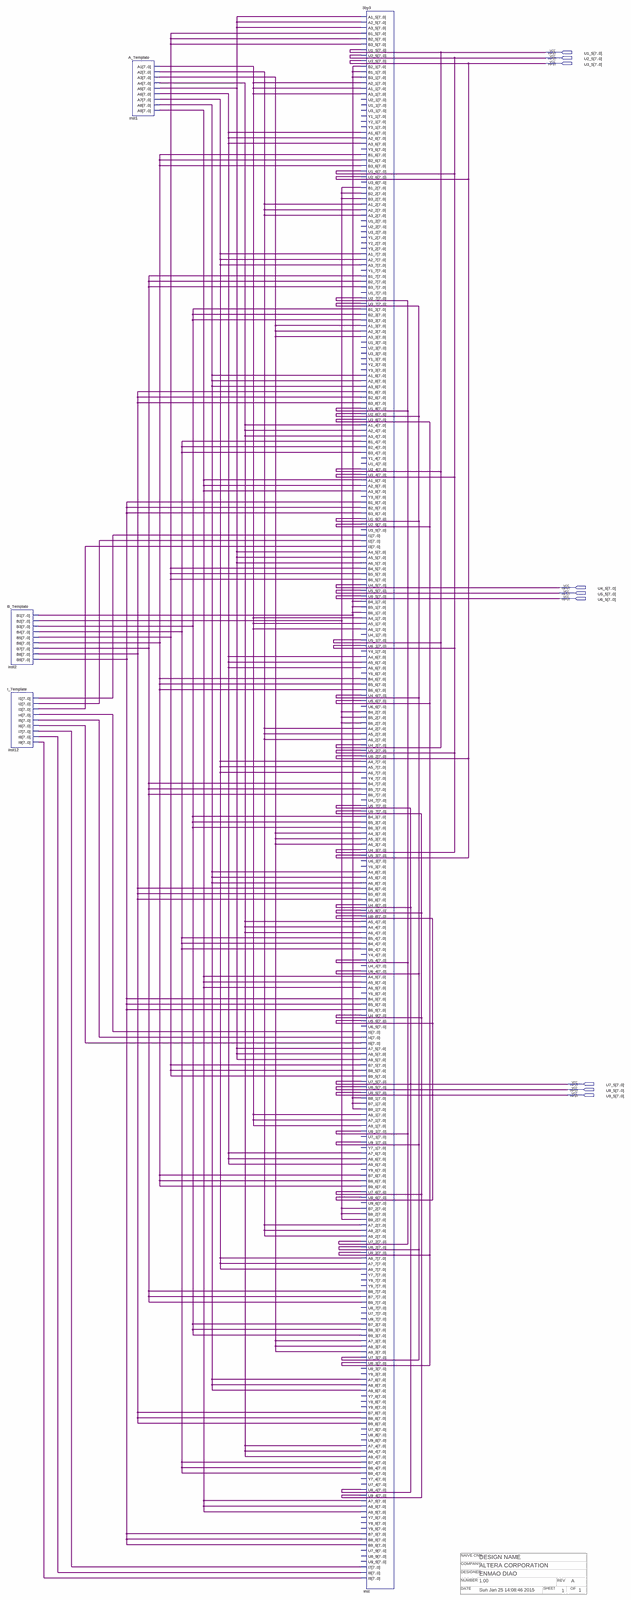
[diagram p0: schematic sheet, whole]
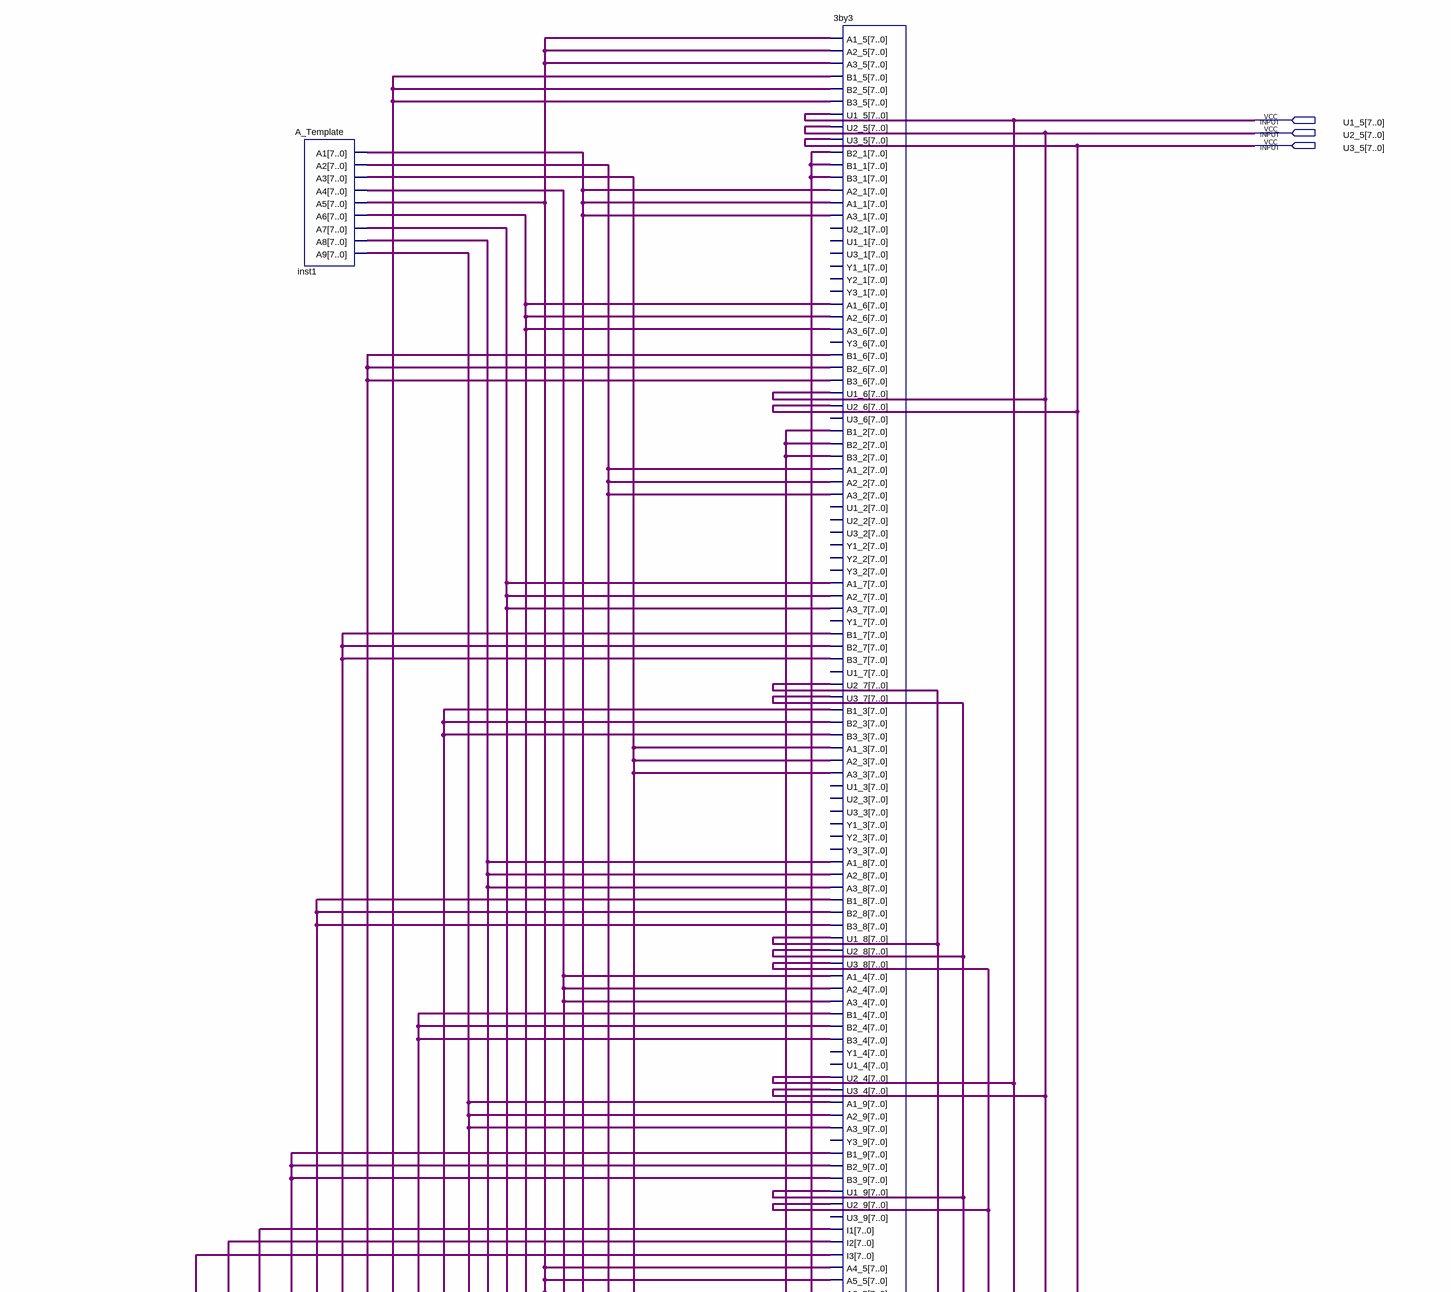
[diagram p1: schematic sheet, upper part]
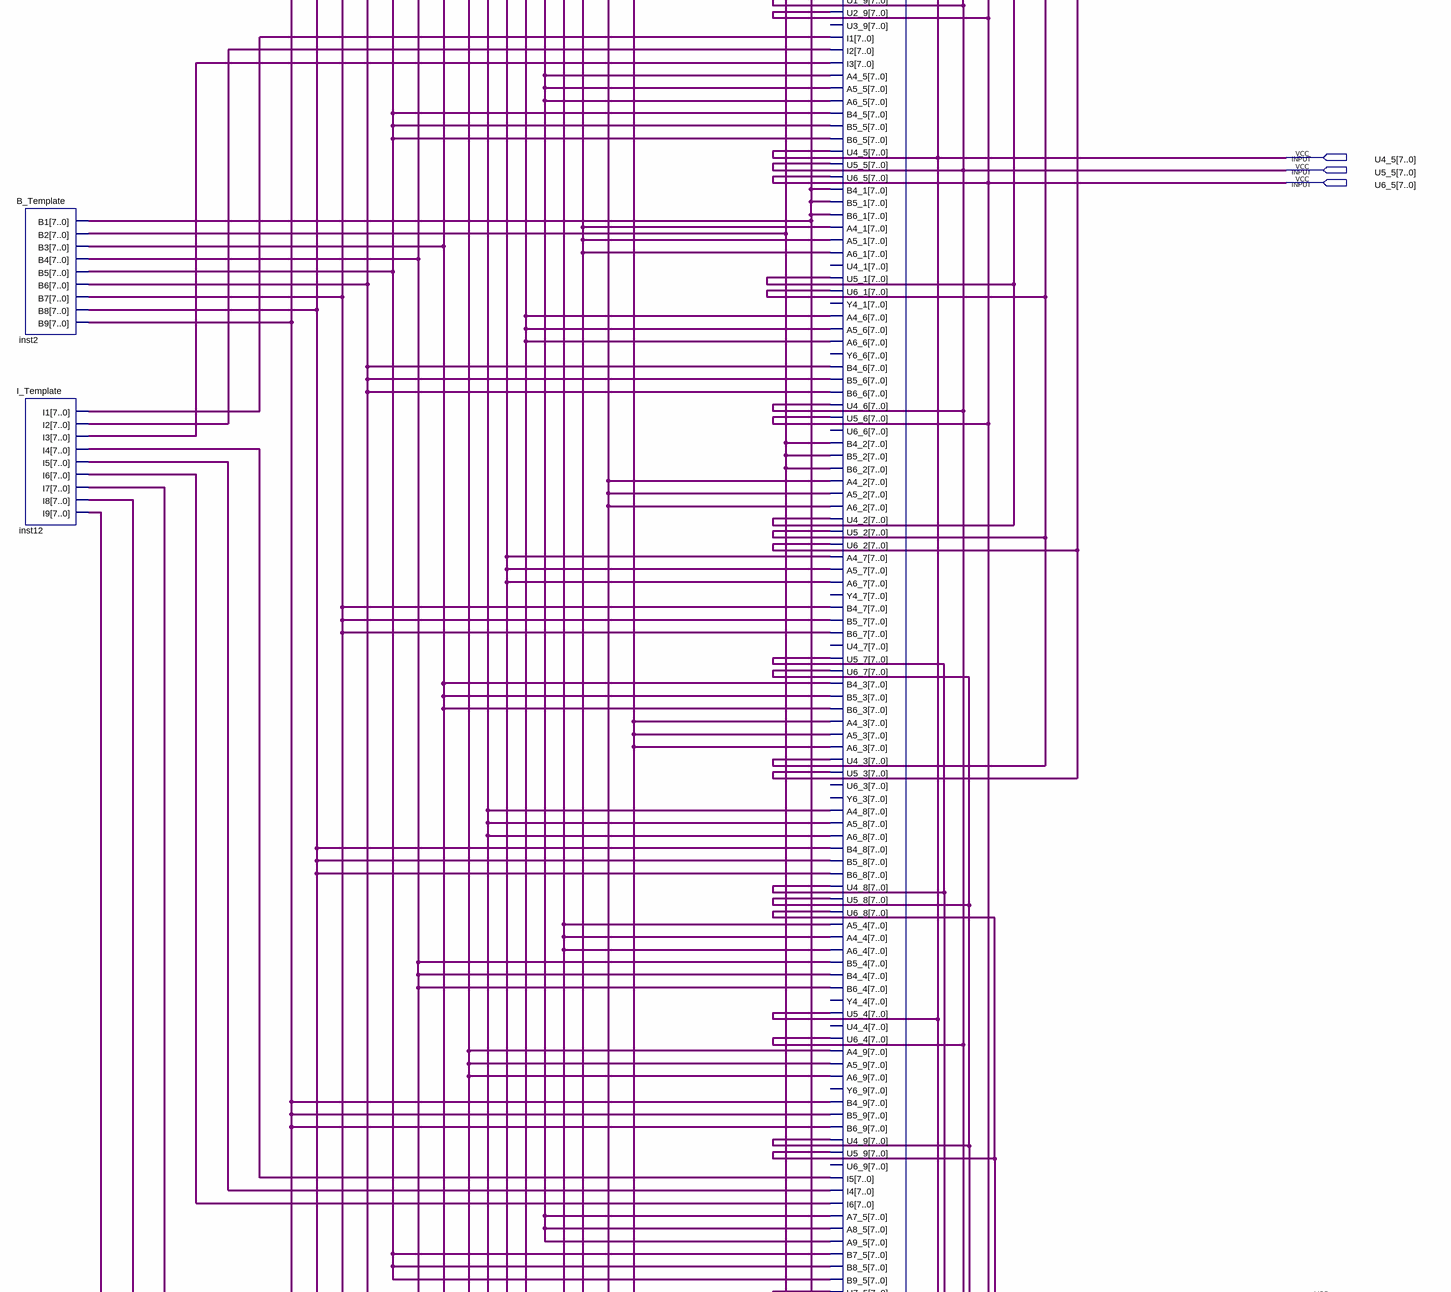
[diagram p2: schematic sheet, middle part]
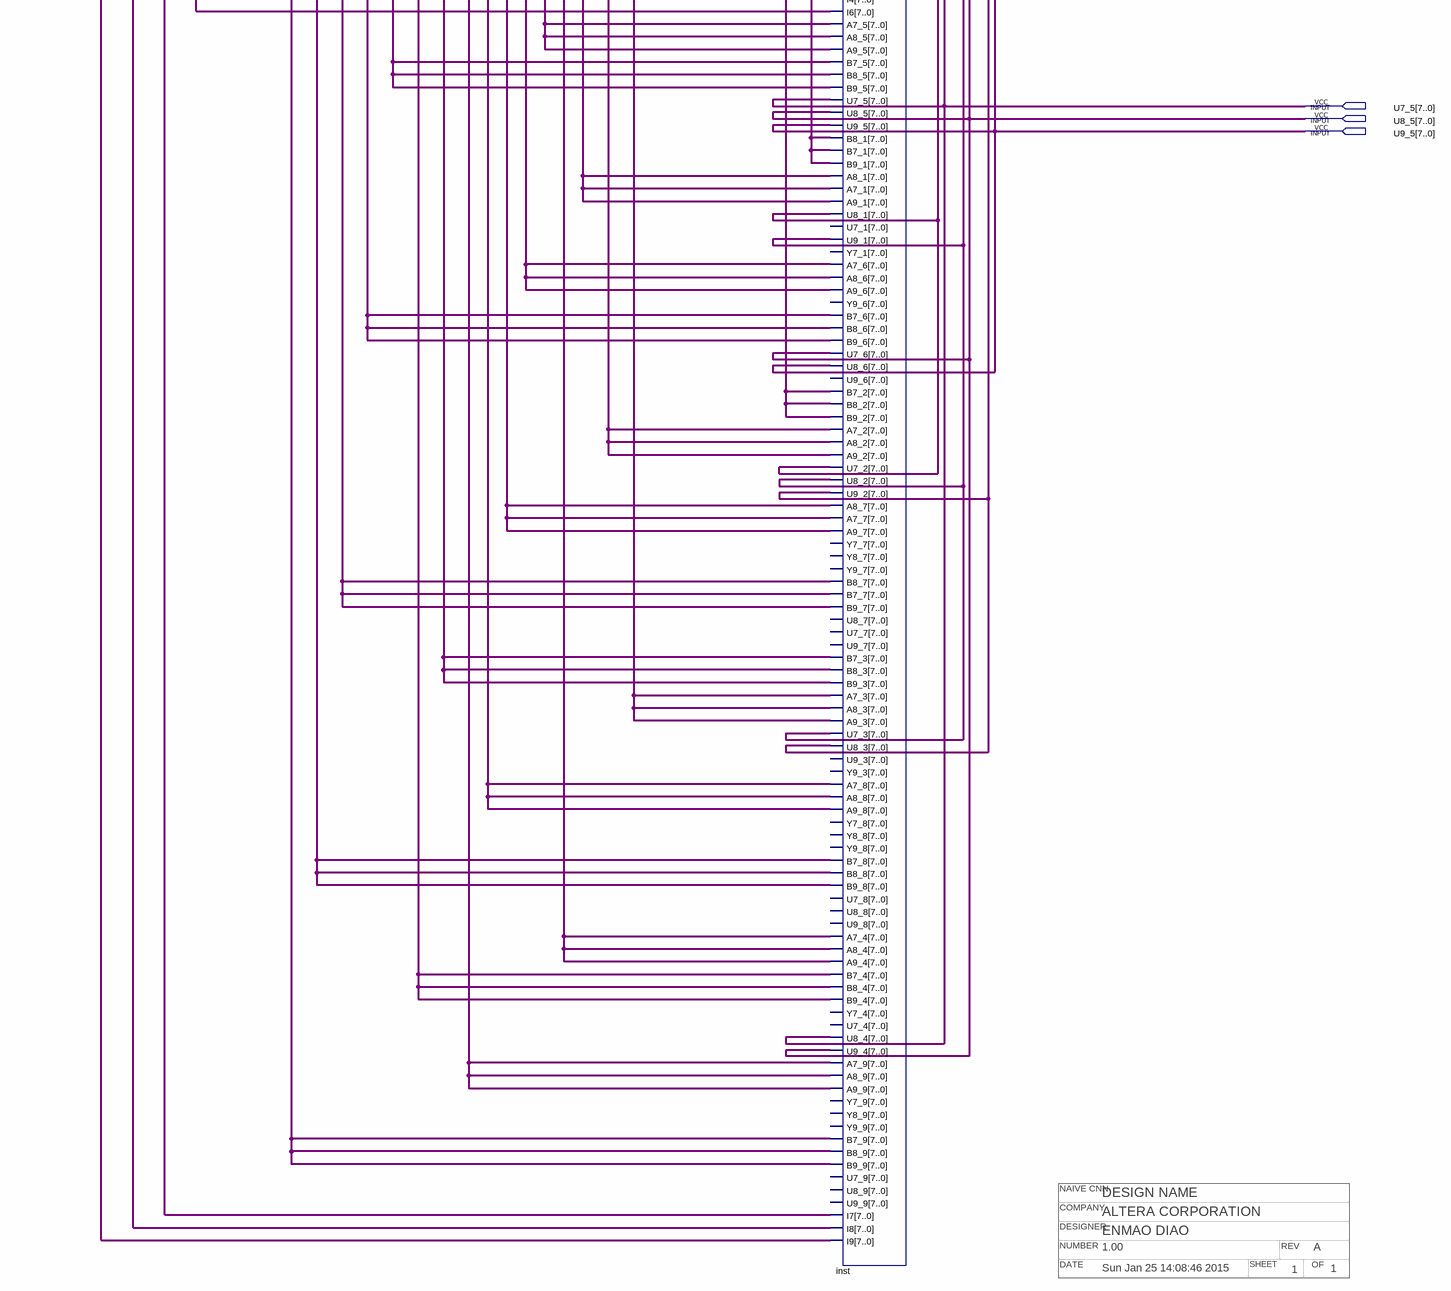
[diagram p3: schematic sheet, lower part]
// Quartus schematic CNN.bdf as structural Verilog: 4 symbols, 9 pins
// Title block: NAIVE CNN: DESIGN NAME; COMPANY: ALTERA CORPORATION; DESIGNER: ENMAO DIAO; NUMBER: 1.00; REV: A; DATE: Sun Jan 25 14:08:46 2015; SHEET: 1; OF: 1
module CNN (
  input  [7:0] U1_5,
  input  [7:0] U2_5,
  input  [7:0] U3_5,
  input  [7:0] U4_5,
  input  [7:0] U5_5,
  input  [7:0] U6_5,
  input  [7:0] U7_5,
  input  [7:0] U8_5,
  input  [7:0] U9_5
);

  wire [7:0] inst1_a1, inst1_a2, inst1_a3, inst1_a4, inst1_a5, inst1_a6, inst1_a7, inst1_a8, inst1_a9,
       inst2_b1, inst2_b2, inst2_b3, inst2_b4, inst2_b5, inst2_b6, inst2_b7, inst2_b8, inst2_b9, inst12_i1,
       inst12_i2, inst12_i3, inst12_i4, inst12_i5, inst12_i6, inst12_i7, inst12_i8, inst12_i9;

  B_Template inst2 (
    .B1(inst2_b1), .B2(inst2_b2), .B3(inst2_b3), .B4(inst2_b4), .B5(inst2_b5), .B6(inst2_b6), .B7(inst2_b7),
    .B8(inst2_b8), .B9(inst2_b9));
  I_Template inst12 (
    .I1(inst12_i1), .I2(inst12_i2), .I3(inst12_i3), .I4(inst12_i4), .I5(inst12_i5), .I6(inst12_i6),
    .I7(inst12_i7), .I8(inst12_i8), .I9(inst12_i9));
  A_Template inst1 (
    .A1(inst1_a1), .A2(inst1_a2), .A3(inst1_a3), .A4(inst1_a4), .A5(inst1_a5), .A6(inst1_a6), .A7(inst1_a7),
    .A8(inst1_a8), .A9(inst1_a9));
  \3by3  inst (
    .A1_5(inst1_a5), .A2_5(inst1_a5), .A3_5(inst1_a5), .B1_5(inst2_b5), .B2_5(inst2_b5), .B3_5(inst2_b5),
    .U1_5(U1_5), .U2_5(U2_5), .U3_5(U3_5), .B2_1(inst2_b1), .B1_1(inst2_b1), .B3_1(inst2_b1),
    .A2_1(inst1_a1), .A1_1(inst1_a1), .A3_1(inst1_a1), .A1_6(inst1_a6), .A2_6(inst1_a6), .A3_6(inst1_a6),
    .B1_6(inst2_b6), .B2_6(inst2_b6), .B3_6(inst2_b6), .U1_6(U2_5), .U2_6(U3_5), .B1_2(inst2_b2),
    .B2_2(inst2_b2), .B3_2(inst2_b2), .A1_2(inst1_a2), .A2_2(inst1_a2), .A3_2(inst1_a2), .A1_7(inst1_a7),
    .A2_7(inst1_a7), .A3_7(inst1_a7), .B1_7(inst2_b7), .B2_7(inst2_b7), .B3_7(inst2_b7), .U2_7(U4_5),
    .U3_7(U5_5), .B1_3(inst2_b3), .B2_3(inst2_b3), .B3_3(inst2_b3), .A1_3(inst1_a3), .A2_3(inst1_a3),
    .A3_3(inst1_a3), .A1_8(inst1_a8), .A2_8(inst1_a8), .A3_8(inst1_a8), .B1_8(inst2_b8), .B2_8(inst2_b8),
    .B3_8(inst2_b8), .U1_8(U4_5), .U2_8(U5_5), .U3_8(U6_5), .A1_4(inst1_a4), .A2_4(inst1_a4),
    .A3_4(inst1_a4), .B1_4(inst2_b4), .B2_4(inst2_b4), .B3_4(inst2_b4), .U2_4(U1_5), .U3_4(U2_5),
    .A1_9(inst1_a9), .A2_9(inst1_a9), .A3_9(inst1_a9), .B1_9(inst2_b9), .B2_9(inst2_b9), .B3_9(inst2_b9),
    .U1_9(U5_5), .U2_9(U6_5), .I1(inst12_i1), .I2(inst12_i2), .I3(inst12_i3), .A4_5(inst1_a5),
    .A5_5(inst1_a5), .A6_5(inst1_a5), .B4_5(inst2_b5), .B5_5(inst2_b5), .B6_5(inst2_b5), .U4_5(U4_5),
    .U5_5(U5_5), .U6_5(U6_5), .B4_1(inst2_b1), .B5_1(inst2_b1), .B6_1(inst2_b1), .A4_1(inst1_a1),
    .A5_1(inst1_a1), .A6_1(inst1_a1), .U5_1(U1_5), .U6_1(U2_5), .A4_6(inst1_a6), .A5_6(inst1_a6),
    .A6_6(inst1_a6), .B4_6(inst2_b6), .B5_6(inst2_b6), .B6_6(inst2_b6), .U4_6(U5_5), .U5_6(U6_5),
    .B4_2(inst2_b2), .B5_2(inst2_b2), .B6_2(inst2_b2), .A4_2(inst1_a2), .A5_2(inst1_a2), .A6_2(inst1_a2),
    .U4_2(U1_5), .U5_2(U2_5), .U6_2(U3_5), .A4_7(inst1_a7), .A5_7(inst1_a7), .A6_7(inst1_a7),
    .B4_7(inst2_b7), .B5_7(inst2_b7), .B6_7(inst2_b7), .U5_7(U7_5), .U6_7(U8_5), .B4_3(inst2_b3),
    .B5_3(inst2_b3), .B6_3(inst2_b3), .A4_3(inst1_a3), .A5_3(inst1_a3), .A6_3(inst1_a3), .U4_3(U2_5),
    .U5_3(U3_5), .A4_8(inst1_a8), .A5_8(inst1_a8), .A6_8(inst1_a8), .B4_8(inst2_b8), .B5_8(inst2_b8),
    .B6_8(inst2_b8), .U4_8(U7_5), .U5_8(U8_5), .U6_8(U9_5), .A5_4(inst1_a4), .A4_4(inst1_a4),
    .A6_4(inst1_a4), .B5_4(inst2_b4), .B4_4(inst2_b4), .B6_4(inst2_b4), .U5_4(U4_5), .U6_4(U5_5),
    .A4_9(inst1_a9), .A5_9(inst1_a9), .A6_9(inst1_a9), .B4_9(inst2_b9), .B5_9(inst2_b9), .B6_9(inst2_b9),
    .U4_9(U8_5), .U5_9(U9_5), .I5(inst12_i4), .I4(inst12_i5), .I6(inst12_i6), .A7_5(inst1_a5),
    .A8_5(inst1_a5), .A9_5(inst1_a5), .B7_5(inst2_b5), .B8_5(inst2_b5), .B9_5(inst2_b5), .U7_5(U7_5),
    .U8_5(U8_5), .U9_5(U9_5), .B8_1(inst2_b1), .B7_1(inst2_b1), .B9_1(inst2_b1), .A8_1(inst1_a1),
    .A7_1(inst1_a1), .A9_1(inst1_a1), .U8_1(U4_5), .U9_1(U5_5), .A7_6(inst1_a6), .A8_6(inst1_a6),
    .A9_6(inst1_a6), .B7_6(inst2_b6), .B8_6(inst2_b6), .B9_6(inst2_b6), .U7_6(U8_5), .U8_6(U9_5),
    .B7_2(inst2_b2), .B8_2(inst2_b2), .B9_2(inst2_b2), .A7_2(inst1_a2), .A8_2(inst1_a2), .A9_2(inst1_a2),
    .U7_2(U4_5), .U8_2(U5_5), .U9_2(U6_5), .A8_7(inst1_a7), .A7_7(inst1_a7), .A9_7(inst1_a7),
    .B8_7(inst2_b7), .B7_7(inst2_b7), .B9_7(inst2_b7), .B7_3(inst2_b3), .B8_3(inst2_b3), .B9_3(inst2_b3),
    .A7_3(inst1_a3), .A8_3(inst1_a3), .A9_3(inst1_a3), .U7_3(U5_5), .U8_3(U6_5), .A7_8(inst1_a8),
    .A8_8(inst1_a8), .A9_8(inst1_a8), .B7_8(inst2_b8), .B8_8(inst2_b8), .B9_8(inst2_b8), .A7_4(inst1_a4),
    .A8_4(inst1_a4), .A9_4(inst1_a4), .B7_4(inst2_b4), .B8_4(inst2_b4), .B9_4(inst2_b4), .U8_4(U7_5),
    .U9_4(U8_5), .A7_9(inst1_a9), .A8_9(inst1_a9), .A9_9(inst1_a9), .B7_9(inst2_b9), .B8_9(inst2_b9),
    .B9_9(inst2_b9), .I7(inst12_i7), .I8(inst12_i8), .I9(inst12_i9));  // open: U2_1, U1_1, U3_1, Y1_1, Y2_1, Y3_1, Y3_6, U3_6, U1_2, U2_2, U3_2, Y1_2, Y2_2, Y3_2, Y1_7, U1_7, U1_3, U2_3, U3_3, Y1_3, Y2_3, Y3_3, Y1_4, U1_4, Y3_9, U3_9, U4_1, Y4_1, Y6_6, U6_6, Y4_7, U4_7, U6_3, Y6_3, Y4_4, U4_4, Y6_9, U6_9, U7_1, Y7_1, Y9_6, U9_6, Y7_7, Y8_7, Y9_7, U8_7, U7_7, U9_7, U9_3, Y9_3, Y7_8, Y8_8, Y9_8, U7_8, U8_8, U9_8, Y7_4, U7_4, Y7_9, Y8_9, Y9_9, U7_9, U8_9, U9_9
endmodule
